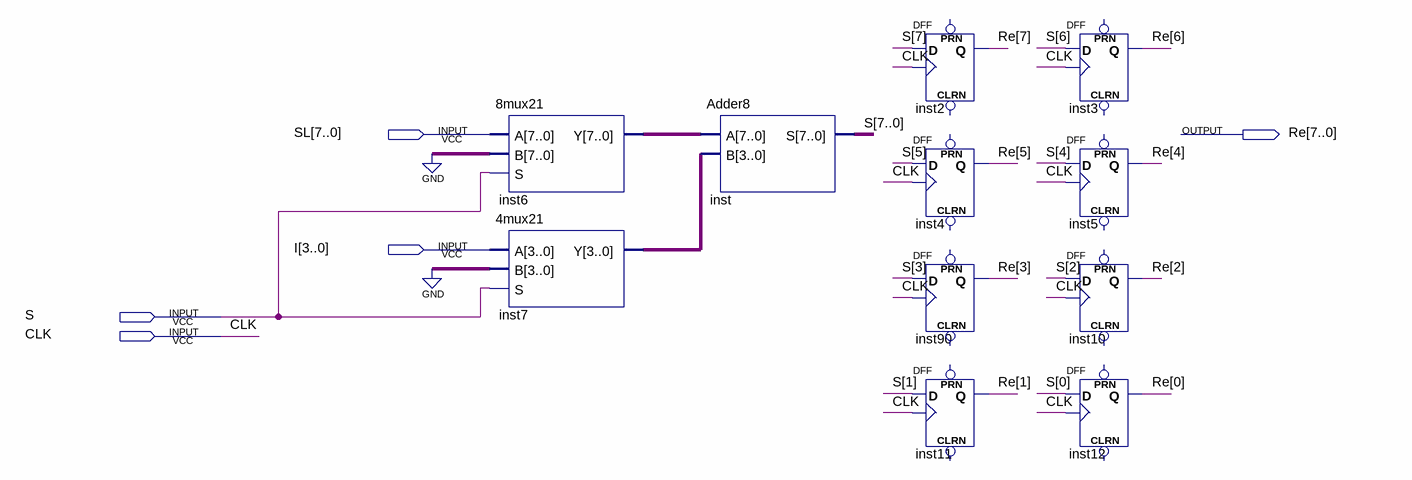
[diagram p0: schematic sheet]
// Quartus schematic Plus8s.bdf as structural Verilog: 11 symbols, 5 pins
module Plus8s (
  input  [7:0] SL,
  input  [3:0] I,
  input  S,
  input  CLK,
  output [7:0] Re
);

  wire [3:0] inst7_y;
  wire [7:0] inst6_y, S_bus;

  \8mux21  inst6 (.A(SL), .B({8{1'b0}}), .S(S), .Y(inst6_y));
  \4mux21  inst7 (.A(I), .B(4'b0000), .S(S), .Y(inst7_y));
  Adder8 inst (.A(inst6_y), .B(inst7_y), .S(S_bus));
  DFF inst2 (.CLK(CLK), .D(S_bus[7]), .Q(Re[7]));  // open: CLRN, PRN
  DFF inst4 (.CLK(CLK), .D(S_bus[5]), .Q(Re[5]));  // open: CLRN, PRN
  DFF inst90 (.CLK(CLK), .D(S_bus[3]), .Q(Re[3]));  // open: CLRN, PRN
  DFF inst11 (.CLK(CLK), .D(S_bus[1]), .Q(Re[1]));  // open: CLRN, PRN
  DFF inst3 (.CLK(CLK), .D(S_bus[6]), .Q(Re[6]));  // open: CLRN, PRN
  DFF inst5 (.CLK(CLK), .D(S_bus[4]), .Q(Re[4]));  // open: CLRN, PRN
  DFF inst10 (.CLK(CLK), .D(S_bus[2]), .Q(Re[2]));  // open: CLRN, PRN
  DFF inst12 (.CLK(CLK), .D(S_bus[0]), .Q(Re[0]));  // open: CLRN, PRN
endmodule
